# EAGLE design reader-and-latch-client-V2016-7-5 (EAGLE 7.5.0)
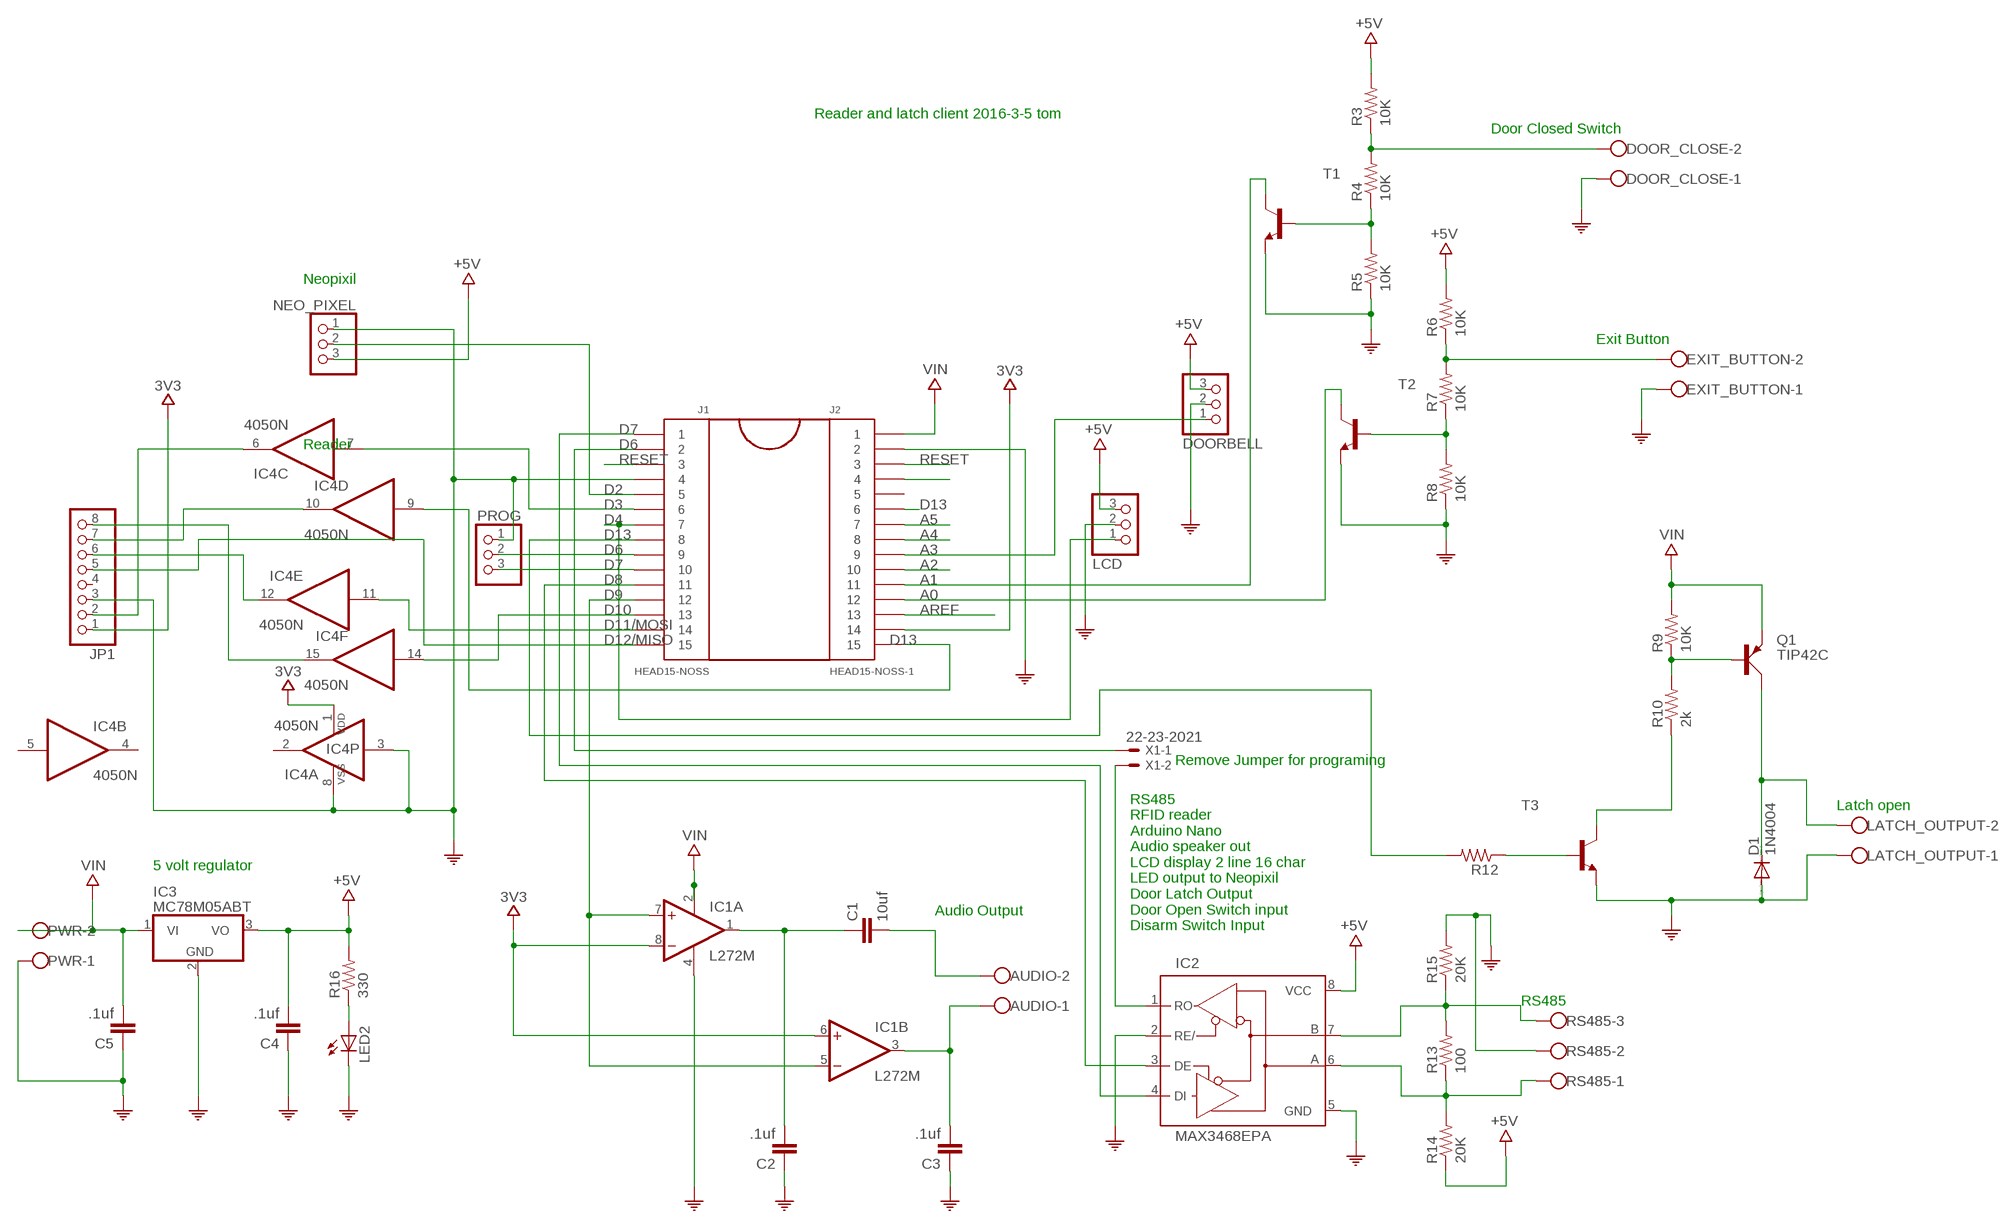
[diagram p0: schematic, sheet 1]

## Parts
AUDIO  W237-102  [W237-102]
C1  10uf  C22/6  [C22.5B6]
C2  .1uf  C5/2.5  [C5B2.5]
C3  .1uf  C5/2.5  [C5B2.5]
C4  .1uf  C5/2.5  [C5B2.5]
C5  .1uf  C5/2.5  [C5B2.5]
D1  1N4004  [DO41-10]
DOOR_CLOSE  W237-102  [W237-102]
DOORBELL  PINHD-1X3  [1X03]
EXIT_BUTTON  W237-102  [W237-102]
IC1  L272M  [DIL08]
IC2  MAX3468EPA  [DIL08]
IC3  MC78M05ABT  [TO220V]
IC4  4050N  [DIL16]
J1  HEAD15-NOSS  [HEAD15-NOSS]
J2  HEAD15-NOSS-1  [HEAD15-NOSS-1]
JP1  PINHD-1X8  [1X08]
LATCH_OUTPUT  W237-102  [W237-102]
LCD  PINHD-1X3  [1X03]
LED2  LED3MM  [LED3MM]
NEO_PIXEL  PINHD-1X3  [1X03]
PROG  PINHD-1X3  [1X03]
PWR  W237-102  [W237-102]
Q1  TIP42C  [TO220AV]
R3  10K  R-US_0207/10  [0207/10]
R4  10K  R-US_0207/10  [0207/10]
R5  10K  R-US_0207/10  [0207/10]
R6  10K  R-US_0207/10  [0207/10]
R7  10K  R-US_0207/10  [0207/10]
R8  10K  R-US_0207/10  [0207/10]
R9  10K  R-US_0207/10  [0207/10]
R10  2k  R-US_0207/10  [0207/10]
R12  R-US_0207/10  [0207/10]
R13  100  R-US_0207/10  [0207/10]
R14  20K  R-US_0207/10  [0207/10]
R15  20K  R-US_0207/10  [0207/10]
R16  330  R-US_0207/10  [0207/10]
RS485  W237-103  [W237-103]
T1  2N3904-NPN-TO92-EBC  [TO92-EBC]
T2  2N3904-NPN-TO92-EBC  [TO92-EBC]
T3  2N3904-NPN-TO92-EBC  [TO92-EBC]
X1  22-23-2021  [22-23-2021]

## Nets
3V3: IC1.6(B:+IN) IC1.8(A:-IN) IC4.1(P:VDD) J2.14 JP1.1
+5V: C4.2 DOORBELL.3 IC2.8(VCC) IC3.3(VO) LCD.3 NEO_PIXEL.3 R3.2 R6.2 R14.1 R16.2
A0: J2.12 T2.C
A1: J2.11 T1.C
A2: J2.10
A3: DOORBELL.1 J2.9
A4: J2.8
A5: J2.7
AREF: J2.13
COM: C2.1 C3.1 C4.1 C5.1 D1.A DOOR_CLOSE.1 DOORBELL.2 EXIT_BUTTON.1 IC1.4(P:GND) IC2.2(RE/) IC2.5(GND) IC3.2(GND) IC4.3(A:I) IC4.8(P:VSS) J1.4 J2.2 JP1.3 LATCH_OUTPUT.1 LCD.2 LED2.K(C) NEO_PIXEL.1 PROG.1 PWR.1 R5.1 R8.1 R15.2 RS485.2 T1.E T2.E T3.E
D2: J1.5 NEO_PIXEL.2
D3: IC4.7(C:I) J1.6
D4: J1.7 LCD.1
D6: J1.2 X1.1
D7: IC2.4(DI) J1.1
D8: IC2.3(DE) J1.11
D9: IC1.5(B:-IN) IC1.7(A:+IN) J1.12
D10: IC4.14(F:I) J1.13
D11/MOSI: IC4.11(E:I) J1.14
D12/MISO: J1.15 JP1.5
D13: J1.8 R12.2
N$1: D1.C LATCH_OUTPUT.2 Q1.C
N$2: R12.1 T3.B
N$3: IC4.6(C:O) JP1.2
N$4: IC2.7(B) R13.2 R15.1 RS485.3
N$5: IC2.6(A) R13.1 R14.2 RS485.1
N$6: J2.6
N$7: J1.9 PROG.2
N$8: J2.4
N$9: C1.1 C2.2 IC1.1(A:OUT)
N$10: AUDIO.2 C1.2
N$11: AUDIO.1 C3.2 IC1.3(B:OUT)
N$12: LED2.A R16.1
N$13: R4.1 R5.2 T1.B
N$14: DOOR_CLOSE.2 R3.1 R4.2
N$15: R7.1 R8.2 T2.B
N$16: EXIT_BUTTON.2 R6.1 R7.2
N$17: R10.1 T3.C
N$18: Q1.B R9.1 R10.2
N$19: IC4.10(D:O) JP1.7
N$20: IC4.12(E:O) JP1.6
N$21: IC4.15(F:O) JP1.8
N$22: J1.10 PROG.3
N$23: IC4.9(D:I) J2.15
N$24: IC2.1(RO) X1.2
RESET: J1.3 J2.3
VIN: C5.2 IC1.2(P:V+) IC3.1(VI) J2.1 PWR.2 Q1.E R9.2
Unconnected: IC4.2(A:O) IC4.4(B:O) IC4.5(B:I) J2.5 JP1.4

## Notes on the sheet
- Reader and latch client 2016-3-5 tom
- Door Closed Switch
- Neopixil
- Exit Button
- Reader
- Remove Jumper for programing
- Latch open
- 5 volt regulator
- Audio Output
- RS485
  RFID reader
  Arduino Nano
  Audio speaker out
  LCD display 2 line 16 char
  LED output to Neopixil
  Door Latch Output
  Door Open Switch input
  Disarm Switch Input
- RS485

## Library data of the parts
AUDIO DOOR_CLOSE EXIT_BUTTON LATCH_OUTPUT PWR = con-wago-500:W237-102: WAGO SCREW CLAMP; MPN: 237-102; OC_FARNELL: unknown; OC_NEWARK: 70K9898
C1-C5 = capacitor-wima:C: CAPACITOR naming: grid - package width
D1 = diode:1N4004: DIODE general purpose rectifier, 1 A
DOORBELL LCD NEO_PIXEL PROG = pinhead:PINHD-1X3: PIN HEADER
IC1 = linear:L272: OP AMP
IC2 = maxim:MAX34*: +5V, Fail-Safe, 40Mbps, Profibus RS-485/RS-422 Transceivers Source: MAX3465-MAX3469.pdf; MPN: MAX3468EPA+; OC_FARNELL: unknown; OC_NEWARK: 78M5804
IC3 = linear:MC78M: 500 mA Positive Voltage Regulators Source: Data sheet <http://www.onsemi.com/pub_link/Collateral/MC78M00-D.PDF>
IC4 = 40xx:4050: Hex non-inverting BUFFER
J1 = MyCON2:HEAD15-NOSS
J2 = MyCON2:HEAD15-NOSS-1
JP1 = pinhead:PINHD-1X8: PIN HEADER
LED2 = SparkFun-LED:LED: LEDs Standard schematic elements and footprints for 5mm, 3mm, 1206, and 0603 sized LEDs. 5mm - Spark Fun Electronics SKU : COM-00529 (and others)
Q1 = transistor-power:TIP42C: PNP TRANSISTOR
R3-R10 R12-R16 = resistor:R-US_: RESISTOR, American symbol
RS485 = con-wago-500:W237-103: WAGO SCREW CLAMP; MPN: 237-103; OC_FARNELL: unknown; OC_NEWARK: 18M7116
T1-T3 = transistor-neu-to92:*-NPN-: NPN Transistror
X1 = con-molex:22-23-2021: .100" (2.54mm) Center Header - 2 Pin; MF: MOLEX; MPN: 22-23-2021; OC_FARNELL: 1462926; OC_NEWARK: 25C3832

## Board
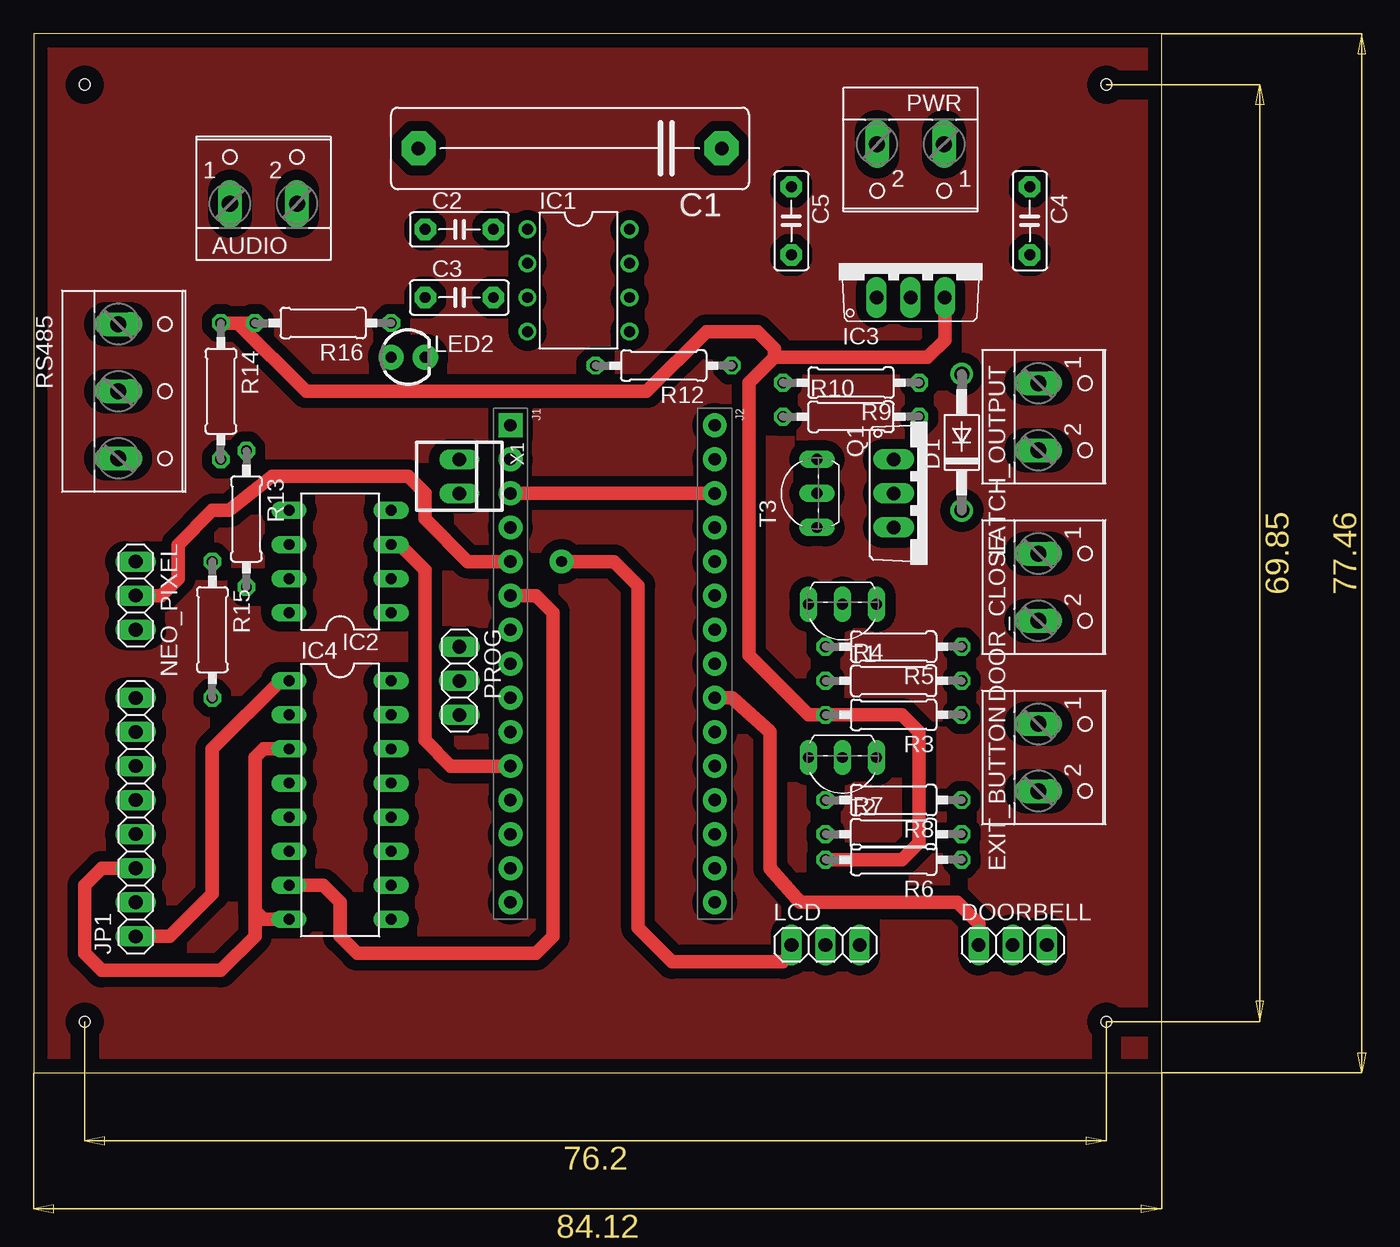
[diagram p1: board, top side]
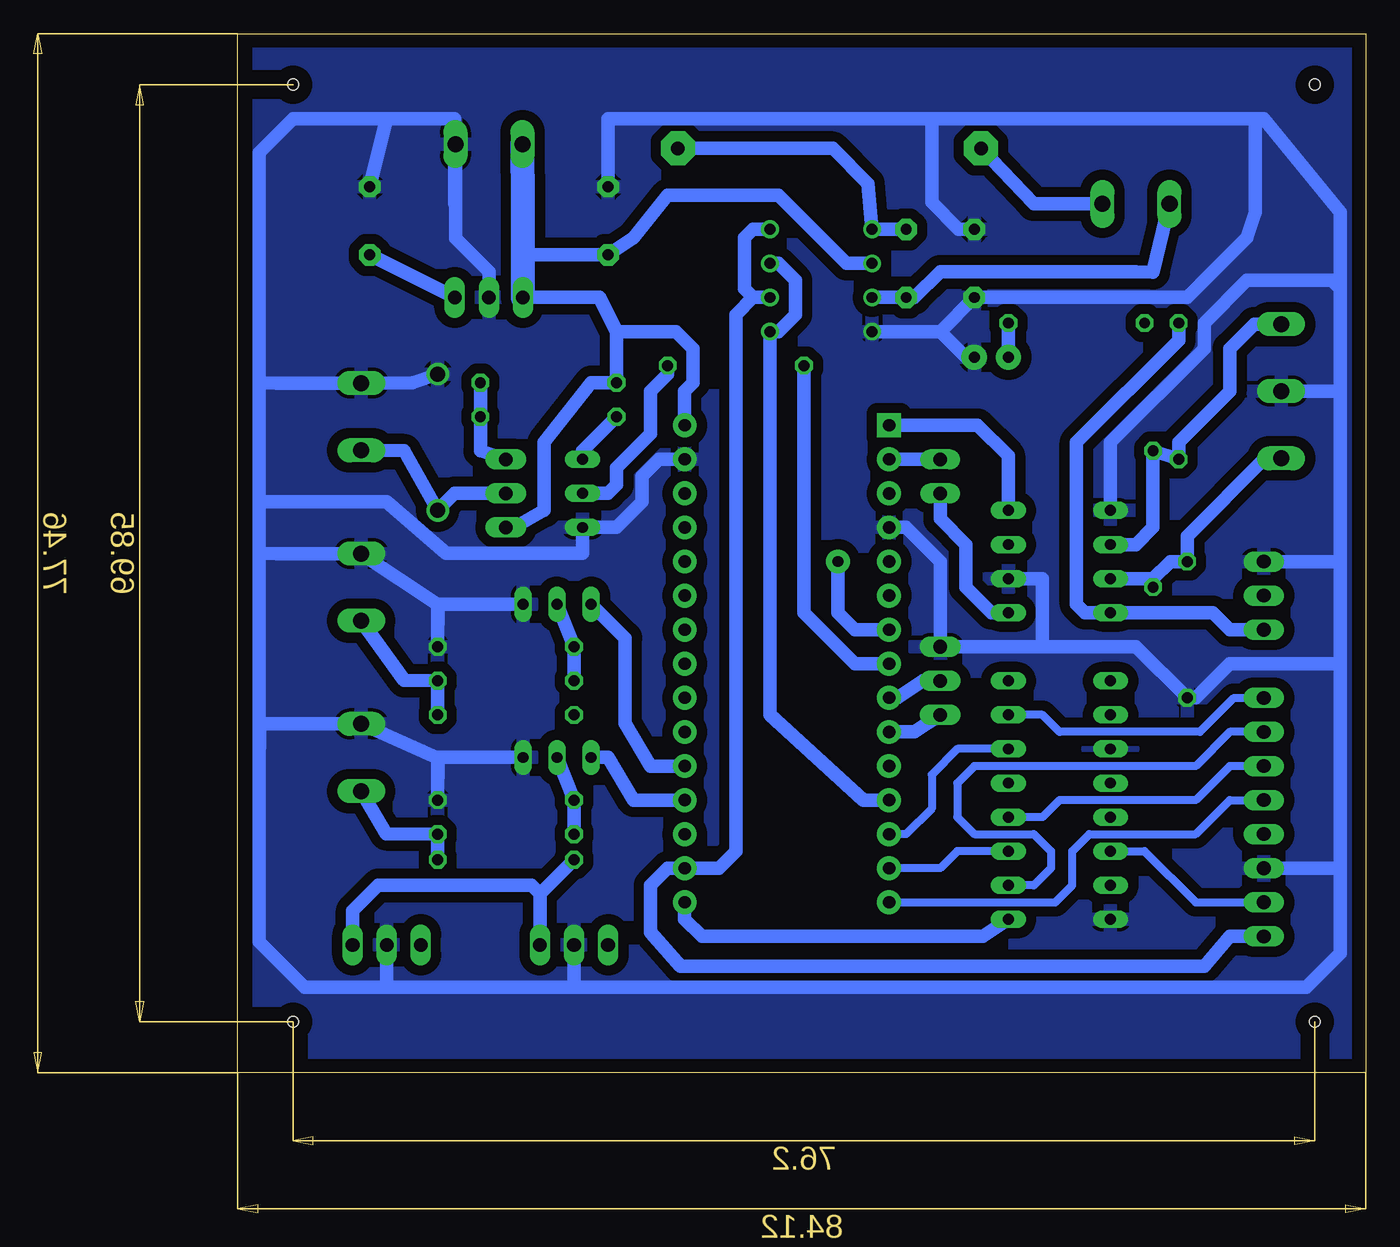
[diagram p2: board, bottom side, seen from below]

Size 84.12 x 77.46 mm. Coordinates in mm from the lower left corner, seen from the top.
Outline: 0,0 84.12,0 84.12,77.46 0,77.46 0,0
Copper layers (1*16): Top 0.035mm / dielectric 1.5mm / Bottom 0.035mm
Design rules "default *": minimum track width 10mil, minimum drill 24mil, track to track 30mil, track to pad 30mil, pad to pad 30mil, via to via 30mil, smd to smd 30mil, copper to edge 40mil, drill to drill 8mil, minimum pad ring 10mil, minimum via ring 8mil, stop-mask expansion 4mil, vias tented up to drill 0mil, thermal gap 10mil
Holes 0.8 mm at 80.01,73.66 80.01,3.81 3.81,3.81 3.81,73.66

### Footprints (pad centres in the part's own frame; a part is rotated, then mirrored left to right if it is on the bottom)
W237-102 = drill 1.194 long: 1 -2.5,-1.27; 2 2.5,-1.27
C22.5B6 = drill 1.016 pad 2.54 octagon: 1 -11.303,0; 2 11.303,0
C5B2.5 = drill 0.813 pad 1.6 octagon: 1 -2.54,0; 2 2.54,0
DO41-10 = drill 1.118: A 5.08,0; C -5.08,0
1X03 = drill 1.016 long: 1 -2.54,0; 2 0,0; 3 2.54,0
DIL08 = drill 0.813 pad 1.27: 1 -3.81,-3.81; 2 -1.27,-3.81; 3 1.27,-3.81; 4 3.81,-3.81; 5 3.81,3.81; 6 1.27,3.81; 7 -1.27,3.81; 8 -3.81,3.81
DIL08' = drill 0.813 long: 1 -3.81,-3.81; 2 -1.27,-3.81; 3 1.27,-3.81; 4 3.81,-3.81; 5 3.81,3.81; 6 1.27,3.81; 7 -1.27,3.81; 8 -3.81,3.81
TO220V = drill 1.016 long: 1 -2.54,-2.54; 2 0,-2.54; 3 2.54,-2.54
DIL16 = drill 0.813 long: 1 -8.89,-3.81; 2 -6.35,-3.81; 3 -3.81,-3.81; 4 -1.27,-3.81; 5 1.27,-3.81; 6 3.81,-3.81; 7 6.35,-3.81; 8 8.89,-3.81; 9 8.89,3.81; 10 6.35,3.81; 11 3.81,3.81; 12 1.27,3.81; 13 -1.27,3.81; 14 -3.81,3.81; 15 -6.35,3.81; 16 -8.89,3.81
HEAD15-NOSS = drill 0.914 pad 1.778 square: 1 0,0 | drill 0.914 pad 1.778: 2 2.54,0; 3 5.08,0; 4 7.62,0; 5 10.16,0; 6 12.7,0; 7 15.24,0; 8 17.78,0; 9 20.32,0; 10 22.86,0; 11 25.4,0; 12 27.94,0; 13 30.48,0; 14 33.02,0; 15 35.56,0
HEAD15-NOSS-1 = drill 0.914 pad 1.778: 1 0,0; 2 2.54,0; 3 5.08,0; 4 7.62,0; 5 10.16,0; 6 12.7,0; 7 15.24,0; 8 17.78,0; 9 20.32,0; 10 22.86,0; 11 25.4,0; 12 27.94,0; 13 30.48,0; 14 33.02,0; 15 35.56,0
1X08 = drill 1.016 long: 1 -8.89,0; 2 -6.35,0; 3 -3.81,0; 4 -1.27,0; 5 1.27,0; 6 3.81,0; 7 6.35,0; 8 8.89,0
LED3MM = drill 0.813 pad 1.88: A -1.27,0; K 1.27,0
TO220AV = drill 1.016 long: B -2.54,-2.54; C 0,-2.54; E 2.54,-2.54
0207/10 = drill 0.813 octagon: 1 -5.08,0; 2 5.08,0
W237-103 = drill 1.194 long: 1 -5,-1.29; 2 0,-1.29; 3 5,-1.29
TO92-EBC = drill 0.813 long: B 0,-1.27; C 2.54,-1.27; E -2.54,-1.27
22-23-2021 = drill 1 long: 1 -1.27,0; 2 1.27,0

### Placement (x,y rotation side)
AUDIO  17.14,66.04 0 top
C1  40.01,68.9 180 top
C2  31.75,62.87 0 top
C3  31.75,57.78 0 top
C4  74.3,63.5 270 top
C5  56.52,63.5 270 top
D1  69.22,46.99 90 top
DOOR_CLOSE  76.2,36.2 270 top
DOORBELL  73.03,9.53 0 top
EXIT_BUTTON  76.2,23.5 270 top
IC1  40.64,59.05 270 top
IC2  MAX3468EPA  [DIL08']  22.86,38.1 90 top
IC3  65.41,60.32 0 top
IC4  22.86,20.32 270 top
J1  35.56,48.26 270 top
J2  50.8,48.26 270 top
JP1  7.62,19.05 90 top
LATCH_OUTPUT  76.2,48.89 270 top
LCD  59.05,9.53 0 top
LED2  27.94,53.34 0 top
NEO_PIXEL  7.62,35.56 270 top
PROG  31.75,29.21 270 top
PWR  65.41,67.95 180 top
Q1  66.67,43.18 270 top
R3  64.14,26.67 180 top
R4  64.14,29.21 0 top
R5  64.14,31.75 180 top
R6  64.14,15.88 180 top
R7  64.14,17.78 0 top
R8  64.14,20.32 180 top
R9  60.96,51.43 180 top
R10  60.96,48.89 0 top
R12  46.99,52.7 180 top
R13  15.88,41.27 270 top
R14  13.97,50.8 270 top
R15  13.34,33.02 270 top
R16  21.59,55.88 180 top
RS485  7.62,50.8 270 top
T1  60.33,33.65 180 top
T2  60.33,22.23 180 top
T3  57.15,43.18 90 top
X1  31.75,44.45 270 top

### Tracks (layer width: path | path; a pad name or v marks a point on that pad's centre or on a via)
3V3
  Top 1.016: IC4.1 18.41,29.21 13.34,24.13 13.34,13.34 10.16,10.16 JP1.1
  Bottom 1.016: 45.72,57.78 46.99,56.51 46.99,16.51 48.26,15.24 J2.14 52.07,15.24 53.34,13.97 53.34,10.48 51.12,7.94 12.06,7.94 10.16,10.16 JP1.1 | IC1.6 45.72,57.78 | 45.72,57.78 46.35,58.42 46.35,62.23 45.72,62.87 IC1.8
+5V
  Top 1.016: 55.24,53.34 66.67,53.34 67.94,54.61 IC3.3 | R6.2 64.77,15.88 66.04,17.14 66.04,25.4 64.77,26.67 R3.2 57.78,26.67 53.34,31.11 53.34,51.43 55.24,53.34 | 55.24,53.34 55.24,53.97 53.98,55.24 50.16,55.24 45.72,50.8 20.32,50.8 15.24,55.88 | 15.24,55.88 R14.1 | R16.2 15.24,55.88
  Bottom 1.016: C4.2 IC3.3 | LCD.3 61.59,13.34 | 61.59,13.34 R6.2 | NEO_PIXEL.3 10.16,33.02 11.43,34.29 IC2.8 20.95,34.29 21.59,34.92 21.59,46.99 13.97,54.61 R14.1 | DOORBELL.3 75.56,12.07 73.66,13.97 62.23,13.97 61.59,13.34
A0
  Bottom 1.016: J2.12 54.61,20.32 56.52,23.5 T2.C
A1
  Bottom 1.016: J2.11 53.34,22.86 55.24,26.04 55.24,32.38 T1.C
A3
  Top 1.016: J2.9 52.07,27.94 54.93,25.4 54.93,15.24 57.15,12.7 68.9,12.7 70.48,11.11 DOORBELL.1
COM
  Top 1.016: IC4.8 17.14,11.43 16.51,12.07 | IC4.3 17.14,24.13 16.51,23.5 16.51,12.07 | 16.51,12.07 16.51,10.16 13.97,7.62 5.08,7.62 3.81,8.89 3.81,13.97 5.08,15.24 JP1.3
  Bottom 1.016: C5.1 56.52,71.12 32.38,71.12 | 32.38,71.12 8.26,71.12 | 8.26,71.12 7.62,71.12 1.91,64.14 1.91,58.42 | 1.91,58.42 1.91,50.8 | 1.91,50.8 1.91,38.1 | 1.91,38.1 1.91,30.48 | 1.91,30.48 1.91,15.24 | 1.91,15.24 1.91,8.89 4.45,6.35 59.05,6.35 | 59.05,6.35 73.03,6.35 | 73.03,6.35 79.13,6.35 82.55,9.77 82.55,22.23 | 82.55,22.23 82.55,38.73 | 82.55,38.73 82.55,42.54 | 82.55,42.54 82.55,51.43 | 82.55,51.43 82.55,68.58 80.01,71.12 73.03,71.12 | 73.03,71.12 67.94,71.12 67.94,64.81 PWR.1 67.91,62.19 65.41,59.69 IC3.2 | C4.1 73.03,71.12 | 82.55,51.43 81.24,51.39 LATCH_OUTPUT.1 71.08,51.43 D1.A | 82.55,38.73 81.24,38.7 DOOR_CLOSE.1 69.17,34.88 R5.1 69.22,34.92 T1.E | 82.55,22.23 82.51,26 EXIT_BUTTON.1 69.17,23.46 R8.1 69.22,23.5 T2.E | 82.55,42.54 73.03,42.54 68.58,38.73 58.42,38.73 T3.E 55.88,40.64 53.98,42.54 53.98,44.45 52.7,45.72 J2.2 | IC1.4 31.75,55.24 | 31.75,55.24 C3.1 13.34,57.78 8.89,62.23 8.26,64.14 8.26,71.12 | C2.1 30.38,62.87 32.38,64.87 32.38,71.12 | RS485.2 1.91,50.8 | NEO_PIXEL.1 1.91,38.1 | IC2.5 19.05,46.99 12.06,53.97 12.06,55.88 8.89,59.05 2.54,59.05 1.91,58.42 | LCD.2 59.05,6.35 | JP1.3 1.91,15.24 | 1.91,30.48 10.16,30.48 12.7,27.94 R15.2 17.14,31.75 24.13,31.75 | J1.4 34.29,40.64 31.75,38.1 PROG.1 24.13,31.75 | IC2.2 24.13,36.83 24.13,31.75 | LED2.K 29.84,53.34 31.75,55.24 | DOORBELL.2 73.03,6.35
  pour Bottom: 0.64,1.27 82.55,1.27 82.55,76.84 1.27,76.84
D2
  Top 1.016: NEO_PIXEL.2 9.53,35.56 10.79,36.83 10.79,39.37 13.34,41.91 14.61,41.91 17.78,44.45 27.94,44.45 29.21,43.18 29.21,41.27 32.38,38.1 J1.5
D3
  Top 1.016: IC4.7 21.59,13.97 22.86,12.7 22.86,10.16 24.13,8.89 37.47,8.89 38.73,10.16 38.73,34.29 37.47,35.56 J1.6
D4  (via drill 0.8 pad 1.78)
  Top 1.016: LCD.1 56.52,8.89 55.88,8.26 47.62,8.26 45.09,10.79 45.09,36.3 43.29,38.1 v39.37,38.1
  Bottom 1.016: v39.37,38.1 39.37,34.29 38.1,33.02 J1.7
D6
  Bottom 1.016: 31.11,45.72 X1.1 J1.2
D7
  Bottom 1.016: J1.1 28.96,48.26 26.67,45.97 IC2.4
D8
  Top 1.016: IC2.3 27.3,39.37 29.21,37.46 29.21,24.77 31.11,22.86 J1.11
D9
  Bottom 1.016: J1.12 37.47,20.32 44.45,26.67 IC1.5 43.81,55.24 42.55,56.51 42.55,59.05 43.81,60.32 IC1.7
D10
  Bottom 0.61: IC4.14 30.48,24.13 32.38,22.23 32.38,19.68 34.29,17.78 J1.13
D11/MOSI
  Bottom 0.61: IC4.11 30.48,16.51 31.75,15.24 J1.14
D12/MISO
  Bottom 0.61: J1.15 23.18,12.7 21.91,13.97 21.91,16.51 20.64,17.78 12.7,17.78 10.16,20.32 JP1.5
D13
  Bottom 1.016: R12.2 41.91,34.29 38.1,30.48 J1.8
GND
  pour Top: 0.64,76.84 83.82,76.84 83.82,0.64 0.64,0.64
N$1
  Bottom 1.016: LATCH_OUTPUT.2 71.72,46.35 D1.C 67.94,43.18 Q1.C
N$2
  Bottom 1.016: R12.1 52.07,52.07 53.34,50.8 53.34,47.62 55.88,45.08 55.88,43.81 56.52,43.18 T3.B
N$3
  Bottom 0.61: IC4.6 16.51,16.51 12.7,12.7 JP1.2
N$4
  Bottom 1.016: RS485.3 7.54,45.8 13.34,40 R15.1 14.61,38.1 15.88,36.83 | 15.88,36.83 IC2.7 | R13.2 15.88,36.83
N$5
  Bottom 1.016: IC2.6 17.14,39.37 15.88,40.64 R13.1 R14.2 13.97,46.99 10.16,50.8 10.16,53.97 8.34,55.8 RS485.1
N$7
  Bottom 1.016: J1.9 34.92,27.94 33.02,29.21 PROG.2
N$9
  Bottom 1.016: C2.2 IC1.1 37.15,66.28 39.77,68.9 C1.1
N$10
  Bottom 1.016: C1.2 24.77,64.77 AUDIO.2
N$11
  Bottom 1.016: IC1.3 C3.2 33.66,57.78 31.75,59.69 17.14,59.69 15.88,59.65 AUDIO.1
N$12
  Bottom 1.016: LED2.A R16.1
N$13
  Bottom 1.016: T1.B R5.2 R4.1
N$14
  Bottom 1.016: R3.1 R4.2 71.72,29.25 DOOR_CLOSE.2
N$15
  Bottom 1.016: T2.B R8.2 R7.1
N$16
  Bottom 1.016: R6.1 R7.2 73.06,17.82 EXIT_BUTTON.2
N$17
  Bottom 1.016: T3.C 58.42,46.35 R10.1
N$18
  Bottom 1.016: R9.1 R10.2 66.04,46.35 Q1.B
N$19
  Bottom 0.61: JP1.7 10.16,25.4 12.7,22.86 29.21,22.86 30.48,21.59 30.48,19.05 29.21,17.78 24.77,17.78 23.5,16.51 23.5,15.24 24.77,13.97 IC4.10
N$20
  Bottom 0.61: JP1.6 10.16,22.86 12.7,20.32 22.86,20.32 24.13,19.05 IC4.12
N$21
  Bottom 0.61: IC4.15 24.13,26.67 22.86,25.4 12.38,25.4 9.84,27.94 JP1.8
N$22
  Bottom 1.016: J1.10 33.66,25.4 PROG.3
N$23
  Bottom 1.016: IC4.9 28.57,10.16 49.53,10.16 50.8,11.43 J2.15
N$24
  Bottom 1.016: IC2.1 27.94,34.29 29.84,36.2 29.84,39.37 31.75,41.27 X1.2
RESET
  Top 1.016: J2.3 J1.3
VIN
  Bottom 1.016: 62.87,60.96 C5.2 54.61,62.23 52.07,65.41 43.81,65.41 38.73,60.32 IC1.2 | Q1.E 63.5,40.64 61.28,41.91 61.28,46.99 57.78,51.43 R9.2 55.88,55.24 | J2.1 50.8,50.8 50.16,51.43 50.16,53.97 51.44,55.24 55.88,55.24 | IC3.1 57.15,57.78 55.88,55.24
  Bottom 1.778: IC3.1 62.87,60.96 62.87,64.81 PWR.2

### Text on the board
tCream: GND | 5v | GND | 3.3v | RX | 5v | 5v | GND | GND